# Altium schematic sheet Commutator.SchDoc
size A4; Organization: OLTEST; Revision: 01; SheetNumber: 1; SheetTotal: 2; Разработчик: Бондарчук С.; Прибор: R100; АМАК.000000.000 Э3: R100.230.070.000-00; Дата: 21.05.2019; Формат: A4; PageSetup: Record=PageOptions|CenterHorizontal=True|CenterVertical=True|PrintScale=0.97|XCorrection=1.00|YCorrection=1.00|PrintKind=1|BorderSize=5000000|LeftOffset=0|BottomOffset=0|Orientation=2|PaperLength=2970|PaperWidth=2100|Scale=100|PaperSource=7|PrintQuality=600|MediaType=1|DitherType=10|PrintScaleMode=1|PaperKind=A4|PaperIndex=9; WorkSpaceName: R100_Boards_v1
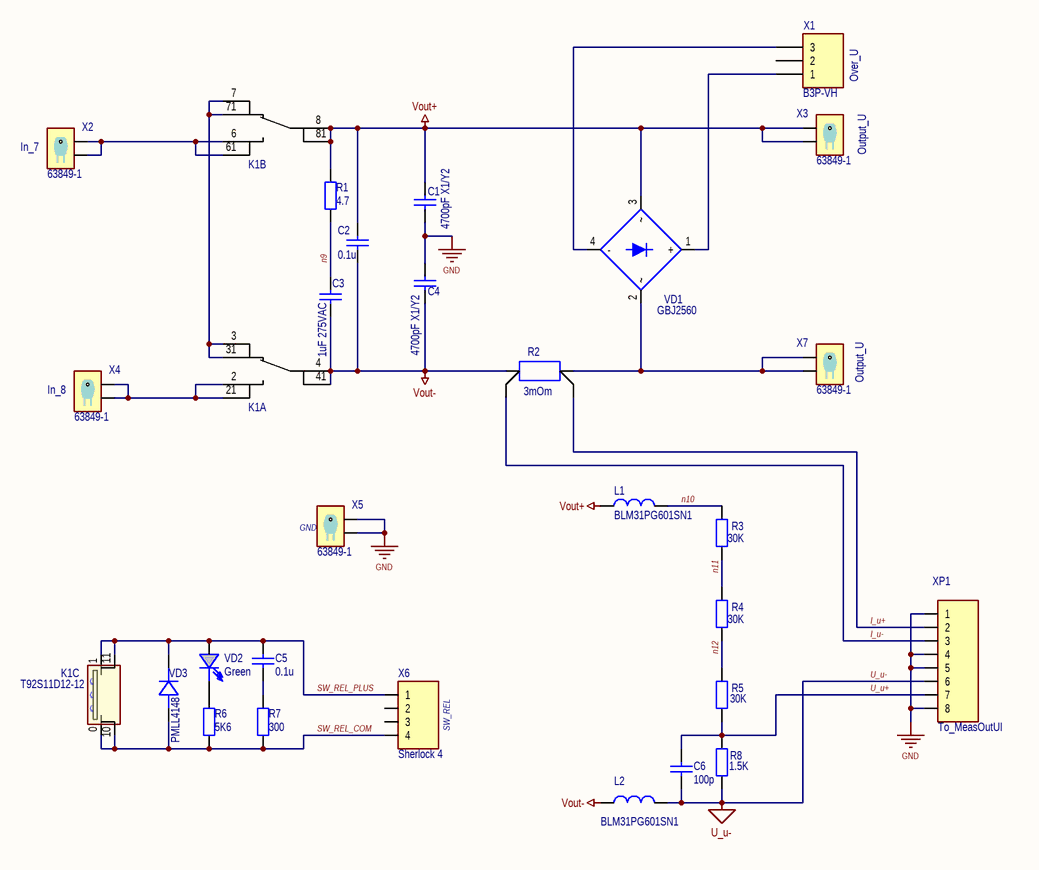
[diagram p0: Commutator.SchDoc]

## Parts
C1  4700pF X1/Y2  [SMD_C_2220]
C2  0.1u  [SMD_C_1812]
C3  1uF 275VAC  [MKP_W13_H24_L31.5_LS27.5]
C4  4700pF X1/Y2  [SMD_C_2220]
C5  0.1u  [SMD_C_0603]
C6  100p  [SMD_C_0603]
K1  (no value)  [T92S11]  (parts A,B,C of 3)
L1  BLM31PG601SN1  [SMD_L_1206]
L2  BLM31PG601SN1  [SMD_L_1206]
R1  4.7  [PRW 5W 1050]
R2  3mOm  [WSL3637 3mOm]
R3  30K  [SMD_R_1206]
R4  30K  [SMD_R_1206]
R5  30K  [SMD_R_1206]
R6  5K6  [SMD_R_0603]
R7  300  [SMD_R_0805]
R8  1.5K  [SMD_R_0805]
VD1  GBJ2560  [GSIB-5S]
VD2  value Green  [SMD_LED_LL_Green]  (hidden comment: LL-S172GC-2A)
VD3  PMLL4148  [SOD80C]
X1  B3P-VH  [B3P-VH]
X2  63849-1  [63849-1+insulator(154719-1)]
X3  63849-1  [63849-1+insulator(154719-1)]
X4  63849-1  [63849-1+insulator(154719-1)]
X5  63849-1  [63849-1+insulator(154719-1)]
X6  Sherlock 4  [35362-0450]
X7  63849-1  [63849-1+insulator(154719-1)]
XP1  То_MeasOutUI  [XP(MeasOutUIBoard)]

## Nets
GND: C1.1 C4.2 X5.1 X5.2 XP1.1 XP1.4 XP1.5 XP1.8
U_u-: C6.1 L2.2 R8.1 XP1.6
Vout+: C1.2 C2.1 K1.8 K1.81 L1.1 R1.2 VD1.3 X3.1 X3.2
Vout-: C2.2 C3.1 C4.1 K1.4 K1.41 L2.1 R2.3(I2)
I_u+: R2.2(E1) XP1.2
I_u-: R2.4(E2) XP1.3
n9: C3.2 R1.1
n10: L1.2 R3.2
n11: R3.1 R4.2
n12: R4.1 R5.2
SW_REL_COM: K1.0 K1.10 R6.1 R7.1 VD3.1(ANODE) X6.4
SW_REL_PLUS: C5.2 K1.1 K1.11 VD2.1(ANODE) VD3.2(CATHODE) X6.1
U_u+: C6.2 R5.1 R8.2 XP1.7
NetC5_1: C5.1 R7.2
NetK1_2: K1.2 K1.21 X4.1 X4.2
NetK1_3: K1.3 K1.7 K1.31 K1.71
NetK1_6: K1.6 K1.61 X2.1 X2.2
NetR2_1: R2.1(I1) VD1.2 X7.1 X7.2
NetR6_2: R6.2 VD2.2(CATHODE)
NetVD1_1: VD1.1(+) X1.1
NetVD1_4: VD1.4(-) X1.3

Not connected (* = marked no-connect by the designer): X1 2; X6 2 3

## Notes on the sheet
- Over_U
- (near X2) In_7
- Output_U
- (near X7) Output_U
- (near X4) In_8
- (near X5) GND
- (near X6) SW_REL
- Разработчик:
- Формат:
- Rev.:
- Лист
- Дата:
- Листов
- WorkSpace:
- Дата изм.:

## Library data of the parts
C1 C4 = C X1Y2 4700pF SMD 2220 250Vac 10%: SMD C2220 MURATA 250Vac 10% X7R X1Y2; PartNumber: GA355DR7GF472kW01; Manufacturer: MURATA; Value: 4700pF X1/Y2
C2 = C1812 0.1u 630V 10%: SMD C 1812 MURATA 630V 10% X7R; PartNumber: GRM43DR72J104K; Manufacturer: MURATA; Value: 0.1u
C3 = MKP-X2 1uF 275VAC +-20% L31.5 H24 W13 LS27.5: Polypropelene MKP-X2 L31.5 H24 W13 LS27.5; PartNumber: MKX21W41006D00M; Manufacturer: Wima; Value: 1uF 275VAC
C5 = C0603 0.1u 50V 10%: SMD C 0603 MURATA 50V 10% X7R; PartNumber: GRM188R71H104K; Manufacturer: MURATA; Value: 0.1u
C6 = C0603 100p 100V 5%: SMD C 0603 MURATA 100V 5% NP0; PartNumber: GRM1885C2A101JA01; Manufacturer: MURATA; Value: 100p
K1 = T92S11D12-12: 400VAC 30A DPDT 12VDC; PartNumber: 1-1393212-0; Manufacturer: TE Connectivity
L1 L2 = BLM31PG601SN1: 600R 1.5A (100MHz); Manufacturer: TDK; PartNumber: BLM31PG601SN1; Value: 600R 1.5A (100MHz)
R1 = PRW 4.7 5W +-5%: Выводной PRW 5W 4R7 +-5%; PartNumber: PRW05WJW47J; Manufacturer: RoyalOhm; Value: 4.7
R2 = WSL3637 3mOm 3W: WSL3637 1mOm 3W 1% 50ppm; PartNumber: WSL36373L000F; Manufacturer: Vishay; Value: 3mOm
R3-R5 = R1206 30K 0.1%: SMD R 1206 VISHAY 0.25W 2000V 0.1% 25ppm; PartNumber: TNPW120630K0BE; Manufacturer: VISHAY; Value: 30K
R6 = R0603 5K6 1%: SMD R 0603 VISHAY 0.1W 75V 1% 100ppm; PartNumber: CRCW06035K60FK; Manufacturer: VISHAY; Value: 5K6
R7 = R0805 300 1%: SMD R 0805 VISHAY 0.125W 150V 1% 100ppm; PartNumber: CRCW0805300RFK; Manufacturer: VISHAY; Value: 300
R8 = R0805 1.5K 0.1%: SMD R 0805 VISHAY 0.125W 150V 0.1% 25ppm; PartNumber: TNPW08051K50BE; Manufacturer: VISHAY; Value: 1.5K
VD1 = GBJ2560: 25A 600V; Manufacturer: Vishay; PartNumber: GSIB2560-E3/45
VD2 = LL-S172GC-2A: LED Green SMD; Manufacturer: Lucky Light; PartNumber: LL-S172GC-2A
VD3 = PMLL4148: If=0.2A, Vf=1V Vrrm=100V Diode (SOD80C); Manufacturer: NXP Semiconductors; PartNumber: PMLL4148
X1 = B3P-VH: VH Top, 10A 250V 3.96mm; Manufacturer: JST; PartNumber: B3P-VH
X2-X5 X7 = 63849-1: PCB, 6.3х0.8, hole; Manufacturer: TE Connectivity; PartNumber: 63849-1
X6 = 35362-0450: Sherlock 4 Top, 2A 125V 2mm; Manufacturer: MOLEX; PartNumber: 35362-0450
XP1 = Plata_MeasOutUI: to MeasOutUI; PartNumber: R100.230.080.000; Manufacturer: OLTEST